# Altium project OTG_HUB.X3.PrjPcb
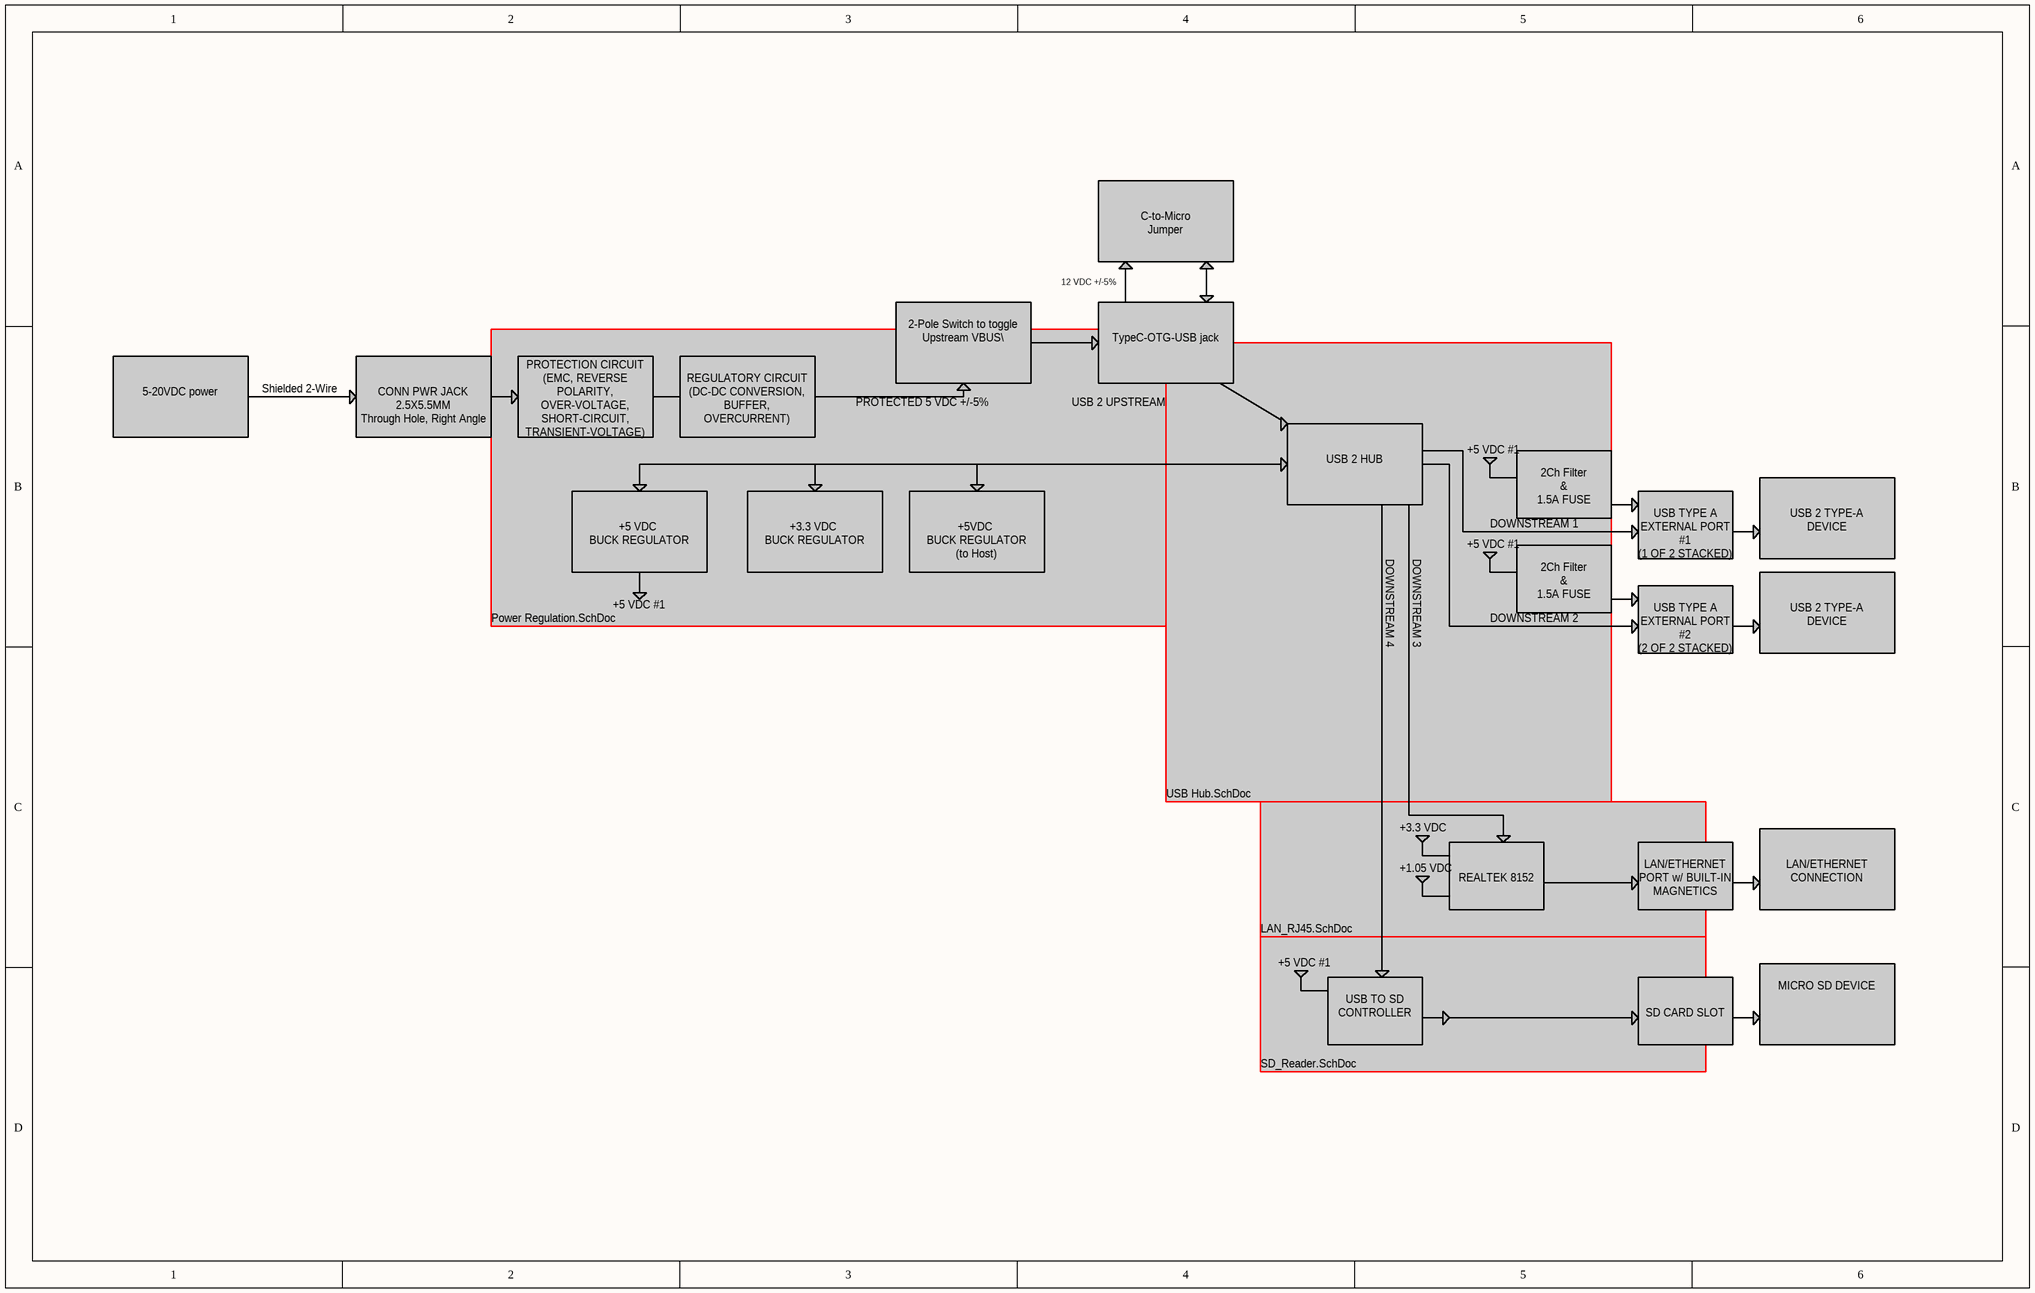
[diagram p0: Block Diagram.SchDoc]
5 sheets, 106 parts. Net scope: global (net labels, ports and power ports of the same name join across sheets).
Board file: OTG_HUB.PcbDoc
Sheets:
  Block Diagram.SchDoc
    12VDC, 5VDC, 5VDC. 3VDC, 1.2VDC = Power Regulation.SchDoc
    12VDC, 5VDC, 5VDC. 3VDC, 1.2VDC = USB Hub.SchDoc
    12VDC, 5VDC, 5VDC. 3VDC, 1.2VDC = LAN_RJ45.SchDoc
    12VDC, 5VDC, 5VDC. 3VDC, 1.2VDC = SD_Reader.SchDoc

## Sheet Block Diagram.SchDoc: OTG PUCK
size B; DrawnBy: KEW; RevisionEngineer: KEW; ProjectTitle: OTG PUCK; Revision: X2; SheetNumber: 1; SheetTotal: 5; RevisionDescription: Initial; DrawnByDate: 10/18/2022; ProjectNumber: TBD; AssemblyNumber: 7150-XXXX; RevisionDate: 10/18/2022; SheetTitle: Block Diagram; Date: 10/18/2022; ApprovedBy: KEW; CheckedBy: KEW; Author: KEW; CompanyName: Gamber-Johnson LLC.; Engineer: KEW; Organization: Gamber-Johnson LLC.; Address1: 5001 Joerns Dr.; Address2: Stevens Point; Address3: WI, 54481; DocumentNumber: TBD; Application_BuildNumber: TBD; Time: 9:29AM

### Sub-sheets
12VDC, 5VDC, 5VDC. 3VDC, 1.2VDC = Power Regulation.SchDoc: no entries
12VDC, 5VDC, 5VDC. 3VDC, 1.2VDC = USB Hub.SchDoc: no entries
12VDC, 5VDC, 5VDC. 3VDC, 1.2VDC = LAN_RJ45.SchDoc: no entries
12VDC, 5VDC, 5VDC. 3VDC, 1.2VDC = SD_Reader.SchDoc: no entries

### Notes on the sheet
- 12 VDC +/-5%
- C-to-Micro
  Jumper
- 5-20VDC power
- Shielded 2-Wire
- CONN PWR JACK 2.5X5.5MM
  Through Hole, Right Angle
- PROTECTION CIRCUIT
  (EMC, REVERSE POLARITY, OVER-VOLTAGE, SHORT-CIRCUIT, TRANSIENT-VOLTAGE)
- REGULATORY CIRCUIT
  (DC-DC CONVERSION,
  BUFFER, OVERCURRENT)
- PROTECTED 5 VDC +/-5%
- 2-Pole Switch to toggle Upstream VBUS\
- USB 2 UPSTREAM
- TypeC-OTG-USB jack
- USB 2 HUB
- +5 VDC #1
- +5 VDC
  BUCK REGULATOR
- +3.3 VDC
  BUCK REGULATOR
- +5VDC
  BUCK REGULATOR
  (to Host)
- DOWNSTREAM 4
- DOWNSTREAM 3
- DOWNSTREAM 1
- 2Ch Filter
  &
  1.5A FUSE
- USB TYPE A
  EXTERNAL PORT #1
  (1 OF 2 STACKED)
- USB 2 TYPE-A
  DEVICE
- DOWNSTREAM 2
- USB TYPE A
  EXTERNAL PORT #2
  (2 OF 2 STACKED)
- +3.3 VDC
- +1.05 VDC
- REALTEK 8152
- LAN/ETHERNET PORT w/ BUILT-IN MAGNETICS
- LAN/ETHERNET CONNECTION
- USB TO SD CONTROLLER
- SD CARD SLOT
- MICRO SD DEVICE
- REV
- REVISIONS
- DATE
- DESCRIPTION
- BY
- UNLESS OTHERWISE SPECIFIED, DRAWING DEFINITIONS AND TOLERANCES SHALL BE FOUND UNDER SUPPLIER STANDARDS SS-001. THIS PART AND ALL COMPONENTS OF IT MUST BE RoHS & REACH COMPLIANT. A CERTIFICATE OF COMPLIANCE MUST BE PROVIDED UPON REQUEST.
- ALL INFORMATION ON THIS DOCUMENT IS THE SOLE PROPERTY OF GAMBER-JOHNSON AND SHALL NOT BE COPIED, REPRODUCED, USED OR DISCLOSED IN WHOLE OR IN PART WITHOUT THE WRITTEN CONSENT OF GAMBER-JOHNSON
- TOLERANCES
  .00 ± .060
  .000 ± .020
  .0000 ± .005
  ANGELS ± 1°
- DRAWN BY:
- PROJECT NUMBER:
- SHEET TITLE:
- SHEET
- OF
- DATE:
- LOCATION:
- ASSEMBLY NUMBER
- SIZE
- GAMBER-JOHNSON LLC
  5001 JOERNS DR.
  STEVENS POINT, WI 54481
  +1 (715) 344-5209
- B

## Sheet Power Regulation.SchDoc: OTG Dock Puck
size A; Date: 12/6/2021; ApprovedBy: KEW; CheckedBy: KEW; Author: KEW; CompanyName: Gamber-Johnson LLC; Engineer: KEW; Organization: Gamber-Johnson LLC; Address1: 5001 Joerns Dr.; Address2: Stevens Point; Address3: WI, 54481; DocumentNumber: KEW-OTG; DrawnBy: KEW; RevisionEngineer: KEW; ProjectTitle: USB-OTG Puck; Revision: X2; SheetNumber: 4; SheetTotal: 5; RevisionDescription: Updated pads for X1,2 and RJ45 Port; DrawnByDate: 1/18/2023; ProjectNumber: TBD; AssemblyNumber: 7150-XXXX; RevisionDate: 1/25/2023; SheetTitle: Power Regulation; Time: 9:34 AM; Application_BuildNumber: 7150-XXX
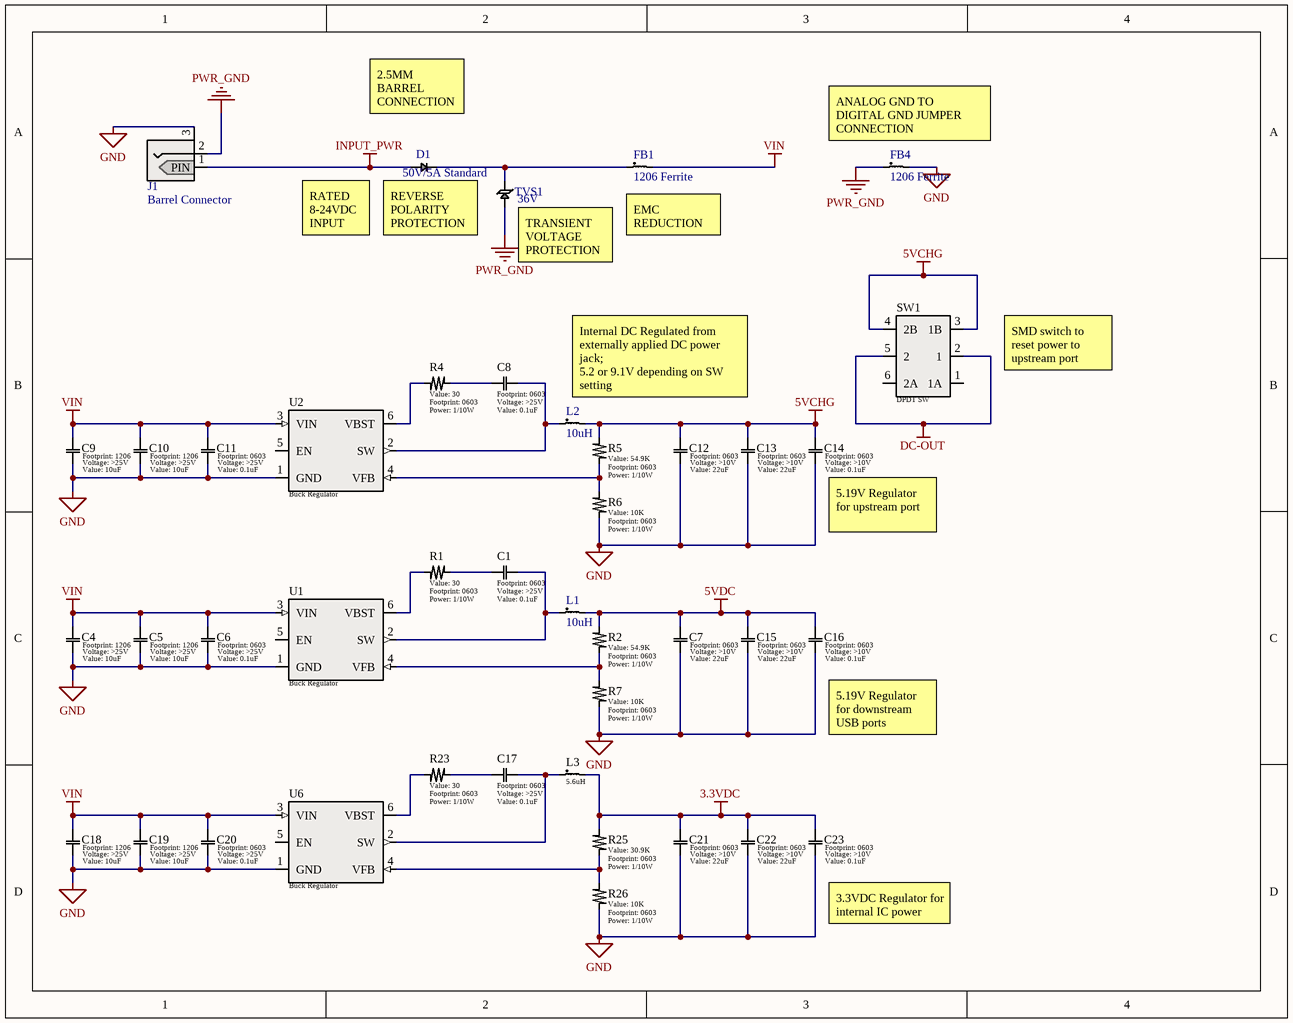
[diagram p1: Power Regulation.SchDoc]

### Parts
C1  value 0.1uF  Voltage: >25V  [0603]  (hidden comment: Generic Capacitor)
C4  value 10uF  Voltage: >25V  [1206]  (hidden comment: Generic Capacitor)
C5  value 10uF  Voltage: >25V  [1206]  (hidden comment: Generic Capacitor)
C6  value 0.1uF  Voltage: >25V  [0603]  (hidden comment: Generic Capacitor)
C7  value 22uF  Voltage: >10V  [0603]  (hidden comment: Generic Capacitor)
C8  value 0.1uF  Voltage: >25V  [0603]  (hidden comment: Generic Capacitor)
C9  value 10uF  Voltage: >25V  [1206]  (hidden comment: Generic Capacitor)
C10  value 10uF  Voltage: >25V  [1206]  (hidden comment: Generic Capacitor)
C11  value 0.1uF  Voltage: >25V  [0603]  (hidden comment: Generic Capacitor)
C12  value 22uF  Voltage: >10V  [0603]  (hidden comment: Generic Capacitor)
C13  value 22uF  Voltage: >10V  [0603]  (hidden comment: Generic Capacitor)
C14  value 0.1uF  Voltage: >10V  [0603]  (hidden comment: Generic Capacitor)
C15  value 22uF  Voltage: >10V  [0603]  (hidden comment: Generic Capacitor)
C16  value 0.1uF  Voltage: >10V  [0603]  (hidden comment: Generic Capacitor)
C17  value 0.1uF  Voltage: >25V  [0603]  (hidden comment: Generic Capacitor)
C18  value 10uF  Voltage: >25V  [1206]  (hidden comment: Generic Capacitor)
C19  value 10uF  Voltage: >25V  [1206]  (hidden comment: Generic Capacitor)
C20  value 0.1uF  Voltage: >25V  [0603]  (hidden comment: Generic Capacitor)
C21  value 22uF  Voltage: >10V  [0603]  (hidden comment: Generic Capacitor)
C22  value 22uF  Voltage: >10V  [0603]  (hidden comment: Generic Capacitor)
C23  value 0.1uF  Voltage: >10V  [0603]  (hidden comment: Generic Capacitor)
D1  50V/5A Standard  [DO-214AC]
FB1  1206 Ferrite  [1206]
FB4  1206 Ferrite  [1206]
J1  Barrel Connector  [PJ-082BH]
L1  10uH  [SMD 8.2x8.6mm]
L2  10uH  [SMD 8.2x8.6mm]
L3  5.6uH  [TMPC0402HP]
R1  value 30  Power: 1/10W  [0603]  (hidden comment: Generic Resistor)
R2  value 54.9K  Power: 1/10W  [0603]  (hidden comment: Generic Resistor)
R4  value 30  Power: 1/10W  [0603]  (hidden comment: Generic Resistor)
R5  value 54.9K  Power: 1/10W  [0603]  (hidden comment: Generic Resistor)
R6  value 10K  Power: 1/10W  [0603]  (hidden comment: Generic Resistor)
R7  value 10K  Power: 1/10W  [0603]  (hidden comment: Generic Resistor)
R23  value 30  Power: 1/10W  [0603]  (hidden comment: Generic Resistor)
R25  value 30.9K  Power: 1/10W  [0603]  (hidden comment: Generic Resistor)
R26  value 10K  Power: 1/10W  [0603]  (hidden comment: Generic Resistor)
SW1  DPDT SW  [SMD-DPDT-SW]
TVS1  36V  [DO-214AC]
U1  Buck Regulator  [TSOT-23-6]
U2  Buck Regulator  [TSOT-23-6]
U6  Buck Regulator  [TSOT-23-6]

### Nets
3.3VDC: C21.1 C22.1 C23.1 L3.2 R25.2
5VCHG: C12.1 C13.1 C14.1 L2.2 R5.2 SW1.3(1B) SW1.4(2B)
5VDC: C7.1 C15.1 C16.1 L1.2 R2.2
DC-OUT: SW1.2(1) SW1.5(2)
GND: C4.2 C5.2 C6.2 C7.2 C9.2 C10.2 C11.2 C12.2 C13.2 C14.2 C15.2 C16.2 C18.2 C19.2 C20.2 C21.2 C22.2 C23.2 FB4.2 J1.3(SHD_B) R6.1 R7.1 R26.1 U1.1(GND) U2.1(GND) U6.1(GND)
INPUT_PWR: D1.2(Anode) J1.1(PIN)
PWR_GND: FB4.1 J1.2(SHD_A) TVS1.2(Anode)
VIN: C4.1 C5.1 C6.1 C9.1 C10.1 C11.1 C18.1 C19.1 C20.1 FB1.2 U1.3(VIN) U2.3(VIN) U6.3(VIN)
NetC1_1: C1.1 R1.2
NetC1_2: C1.2 L1.1 U1.2(SW)
NetC8_1: C8.1 R4.2
NetC8_2: C8.2 L2.1 U2.2(SW)
NetC17_1: C17.1 R23.2
NetC17_2: C17.2 L3.1 U6.2(SW)
NetD1_1: D1.1(Cathode) FB1.1 TVS1.1(Cathode)
NetR1_1: R1.1 U1.6(VBST)
NetR2_1: R2.1 R7.2 U1.4(VFB)
NetR4_1: R4.1 U2.6(VBST)
NetR5_1: R5.1 R6.2 U2.4(VFB)
NetR23_1: R23.1 U6.6(VBST)
NetR25_1: R25.1 R26.2 U6.4(VFB)

Not connected (* = marked no-connect by the designer): SW1 1(1A) 6(2A); U1 5(EN); U2 5(EN); U6 5(EN)

### Notes on the sheet
- 2.5MM BARREL CONNECTION
- (near FB4) ANALOG GND TO DIGITAL GND JUMPER CONNECTION
- (near D1) RATED 8-24VDC INPUT
- (near D1) REVERSE POLARITY PROTECTION
- (near FB1) EMC REDUCTION
- (near TVS1) TRANSIENT VOLTAGE PROTECTION
- SMD switch to reset power to upstream port
- (near L2) Internal DC Regulated from
  externally applied DC power jack;
  5.2 or 9.1V depending on SW setting
- (near C14) 5.19V Regulator for upstream port
- (near C16) 5.19V Regulator for downstream USB ports
- (near C23) 3.3VDC Regulator for internal IC power
- REV
- REVISIONS
- DATE
- DESCRIPTION
- BY
- UNLESS OTHERWISE SPECIFIED, DRAWING DEFINITIONS AND TOLERANCES SHALL BE FOUND UNDER SUPPLIER STANDARDS SS-001. THIS PART AND ALL COMPONENTS OF IT MUST BE RoHS & REACH COMPLIANT. A CERTIFICATE OF COMPLIANCE MUST BE PROVIDED UPON REQUEST.
- ALL INFORMATION ON THIS DOCUMENT IS THE SOLE PROPERTY OF GAMBER-JOHNSON AND SHALL NOT BE COPIED, REPRODUCED, USED OR DISCLOSED IN WHOLE OR IN PART WITHOUT THE WRITTEN CONSENT OF GAMBER-JOHNSON
- TOLERANCES
  .00 ± .060
  .000 ± .020
  .0000 ± .005
  ANGELS ± 1°
- DRAWN BY:
- PROJECT NUMBER:
- SHEET TITLE:
- SHEET
- OF
- DATE:
- LOCATION:
- ASSEMBLY NUMBER
- SIZE
- GAMBER-JOHNSON LLC
  3001 BORHAM AVE.
  STEVENS POINT, WI 54481
  +1 (715) 344-5209
- B

### Library data of the parts
C1 C4-C6 C8-C11 C14 C16-C20 C23 = Generic Capacitor: Tolerance: 10%
C7 C12 C13 C15 C21 C22 = Generic Capacitor: Tolerance: 20%
D1 = SBRT5A50SA-13: Diode Super Barrier 50V 5A Surface Mount; Manufacturer 1: Diodes; Element Configuration: Single; Forward Voltage: 460mV; Max Forward Surge Current (Ifsm): 70A; Max Reverse Current: 45mA; Supplier 1: Digi-Key; Manufacturer Part Number 1: SBRT5A50SA-13; RoHS: Yes; Category: Rectifier Diodes; Stock 1: 218992; Pricing 1: 1=0.49000, 10=0.38200, 100=0.22900, 500=0.21200, 1000=0.14416, 2000=0.13271 (USD); Mount: Surface Mount; Case/Package: SMA; Weight: 0.002258oz; Min Operating Temperature: -55°C; Max Operating Temperature: 150°C; Packaging: Tape and Reel; Average Rectified Current: 5A; Max Repetitive Reverse Voltage (Vrrm): 50V; Package Quantity: 5000; Max Reverse Voltage (DC): 50V; Lead Free: Lead Free; RoHS Compliant: Yes; ComponentLink1URL: http://www.farnell.com/datasheets/2814462.pdf?src-supplier=Farnell; ComponentLink1Description: http://www.farnell.com/datasheets/2814462.pdf?src-supplier=Farnell; ComponentLink2URL: https://www.diodes.com/assets/Datasheets/SBRT5A50SA.pdf?src-supplier=Arrow+Electronics; ComponentLink2Description: https://www.diodes.com/assets/Datasheets/SBRT5A50SA.pdf?src-supplier=Arrow+Electronics; ComponentLink3URL: https://www.diodes.com/assets/Datasheets/SBRT5A50SA.pdf?src-supplier=Mouser; ComponentLink3Description: https://www.diodes.com/assets/Datasheets/SBRT5A50SA.pdf?src-supplier=Mouser; ComponentLink4URL: https://www.diodes.com/assets/Datasheets/SBRT5A50SA.pdf?src-supplier=Avnet+Europe; ComponentLink4Description: https://www.diodes.com/assets/Datasheets/SBRT5A50SA.pdf?src-supplier=Avnet+Europe; ComponentLink5URL: http://www.farnell.com/datasheets/2814462.pdf?src-supplier=Newark; ComponentLink5Description: http://www.farnell.com/datasheets/2814462.pdf?src-supplier=Newark; ComponentLink6URL: https://www.diodes.com/assets/Datasheets/SBRT5A50SA.pdf?src-supplier=Avnet; ComponentLink6Description: https://www.diodes.com/assets/Datasheets/SBRT5A50SA.pdf?src-supplier=Avnet; ComponentLink7URL: https://www.diodes.com/assets/Datasheets/SBRT5A50SA.pdf?src-supplier=Digi-Key; ComponentLink7Description: https://www.diodes.com/assets/Datasheets/SBRT5A50SA.pdf?src-supplier=Digi-Key; ComponentLink8URL: http://www.farnell.com/datasheets/2814462.pdf?src-supplier=Element14; ComponentLink8Description: http://www.farnell.com/datasheets/2814462.pdf?src-supplier=Element14; ComponentLink9URL: https://www.diodes.com/assets/Datasheets/SBRT5A50SA.pdf?src-supplier=Verical; ComponentLink9Description: https://www.diodes.com/assets/Datasheets/SBRT5A50SA.pdf?src-supplier=Verical; Supplier Part Number 1: SBRT5A50SA-13DICT-ND
FB1 FB4 = HI1206T161R-10: 160 Ohms @ 100MHz 1 Power, Signal Line Ferrite Bead 1206 (3216 Metric) 6A 18mOhm; Manufacturer 1: Laird Steward; DC Resistance (DCR): 18mR; Number of Lines: 1; Impedance: 160R; Supplier 1: Digi-Key; Manufacturer Part Number 1: HI1206T161R-10; RoHS: Yes; Category: Fixed Inductors; Stock 1: 250713; Pricing 1: 1=0.20000, 10=0.15600, 25=0.12920, 50=0.11140, 100=0.10020, 250=0.08464, 500=0.07572, 1000=0.06458 (USD); Mount: Surface Mount; Case/Package: 1206; Weight: 0.0136oz; Case Code (Metric): 3216; Case Code (Imperial): 1206; Core Material: Ferrite; Material: Ferrite; Min Operating Temperature: -40°C; Max Operating Temperature: 125°C; Package Quantity: 1; Packaging: Tape and Reel; Max Current Rating: 6A; Current Rating: 6A; Max DC Current: 6A; Termination: SMD/SMT; Frequency: 100MHz; Test Frequency: 100MHz; Length: 3.2mm; Height: 0.071inch; Width: 0.063inch; Depth: 1.8mm; Lead Free: Lead Free; REACH SVHC: Unknown; ComponentLink1URL: https://datasheet.ciiva.com/22622/1685743-22622771.pdf?src-supplier=Element14; ComponentLink1Description: https://datasheet.ciiva.com/22622/1685743-22622771.pdf?src-supplier=Element14; ComponentLink2URL: https://datasheet.ciiva.com/16714/70065439-16714326.pdf?src-supplier=Allied+Electronics; ComponentLink2Description: https://datasheet.ciiva.com/16714/70065439-16714326.pdf?src-supplier=Allied+Electronics; Supplier Part Number 1: 240-2411-1-ND; LCSC PN: C391193
J1 = PJ-082BH: CONN PWR JACK 2.5X5.5MM SOLDER; Manufacturer 1: CUI; Gender: Male; Shielding: Shielded; Current Rating: 10A; Number of Conductors: 2; Supplier 1: Digi-Key; Manufacturer Part Number 1: PJ-082BH; RoHS: Yes; Category: Connectors; Stock 1: 24371; Pricing 1: 1=1.69000, 10=1.53600, 25=1.44200, 50=1.37940, 100=1.31670 (USD); Mount: Through Hole; Color: Black; Contact Material: Brass; Housing Material: Nylon; Contact Plating: Silver; Housing Color: Black; Min Operating Temperature: -25°C; Max Operating Temperature: 85°C; Orientation: Horizontal; Connector Type: Jack; Termination: Solder; Lead Free: Lead Free; ComponentLink1URL: https://datasheet.ciiva.com/7368/pj-082bh-7368042.pdf?src-supplier=Digi-Key; ComponentLink1Description: https://datasheet.ciiva.com/7368/pj-082bh-7368042.pdf?src-supplier=Digi-Key; ComponentLink2URL: https://datasheet.ciiva.com/7368/pj-082bh-7368045.pdf?src-supplier=Digi-Key; ComponentLink2Description: https://datasheet.ciiva.com/7368/pj-082bh-7368045.pdf?src-supplier=Digi-Key; Supplier Part Number 1: CP-082BHCT-ND; LCSC PN: C3001296
L1 L2 = IHLP3232DZER100M5A: 5.1A 10uH ±20% 5.2A - Power Inductor; Mfr_Name: Vishay; Type: DEV; Copyright: Copyright (C) 2023 Ultra Librarian. All rights reserved.; Manufacturer_Part_Number: IHLP3232DZER100M5A; RefDes: RefDes; LCSC PN: C2051768; Supplier 1: Mouser
L3 = TMPC0402HP-5R6MG-Z02: 2A 5.6uH ±20% SMD Power Inductor; LCSC PN: C357137; Supplier 1: Digi-Key; Supplier Part Number 1: 732-3339-1-ND
R1 R2 R4-R7 R23 R25 R26 = Generic Resistor: Tolerance: 1%
SW1 = MS-22D17-G2: Brick nogging DPDT Black SMD Slide Switch; LCSC PN: C2904912
TVS1 = SMAJ36A: 58.1V Clamp 6.9A Ipp Tvs Diode Surface Mount DO-214AC (SMA); Manufacturer 1: Littelfuse; Peak Pulse Power: 400W; Polarity: Unidirectional; Breakdown Voltage: 40V; Test Current: 1mA; Number of Channels: 1; Leakage Current: 1uA; Max Power Dissipation: 3.3W; Power Line Protection: No; Max Breakdown Voltage: 44.2V; Supplier 1: Digi-Key; Manufacturer Part Number 1: SMAJ36A; RoHS: Yes; Category: TVS Diodes; Stock 1: 65200; Pricing 1: 1=0.41000, 10=0.27500, 100=0.15750, 500=0.11000, 1000=0.08750, 2000=0.08500 (USD); Mount: Surface Mount; Number of Pins: 2; Min Operating Temperature: -65°C; Max Operating Temperature: 150°C; Clamping Voltage: 58.1V; Packaging: Tape and Reel; Reverse Standoff Voltage: 36V; Peak Pulse Current: 6.9A; Max Surge Current: 6.9A; Package Quantity: 5000; Operating Supply Voltage: 36V; Reverse Breakdown Voltage: 40V; Min Breakdown Voltage: 40V; Number of Elements: 1; Termination: SMD/SMT; Direction: Unidirectional; Resistor Type: Zener; Number of Unidirectional Channels: 1; Voltage Rating (DC): 36V; Power Dissipation: 400W; Length: 5.28mm; Height: 2.29mm; Width: 2.79mm; Lead Free: Lead Free; REACH SVHC: No SVHC; ComponentLink1URL: https://datasheet.ciiva.com/330/littelfuse-tvs-diode-smaj-datasheet-pdf-330760.pdf?src-supplier=Digi-Key; ComponentLink1Description: https://datasheet.ciiva.com/330/littelfuse-tvs-diode-smaj-datasheet-pdf-330760.pdf?src-supplier=Digi-Key; ComponentLink2URL: https://datasheet.ciiva.com/330/littelfuse-tvs-diode-smaj-datasheet-pdf-330762.pdf?src-supplier=Digi-Key; ComponentLink2Description: https://datasheet.ciiva.com/330/littelfuse-tvs-diode-smaj-datasheet-pdf-330762.pdf?src-supplier=Digi-Key; ComponentLink3URL: https://datasheet.ciiva.com/28473/607617-28473423.pdf?src-supplier=Element14; ComponentLink3Description: https://datasheet.ciiva.com/28473/607617-28473423.pdf?src-supplier=Element14; ComponentLink4URL: https://datasheet.ciiva.com/330/littelfuse-tvs-diode-smaj-datasheet-pdf-330761.pdf?src-supplier=Digi-Key; ComponentLink4Description: https://datasheet.ciiva.com/330/littelfuse-tvs-diode-smaj-datasheet-pdf-330761.pdf?src-supplier=Digi-Key; ComponentLink5URL: https://datasheet.ciiva.com/16487/littelfuse-tvs-diode-smaj-16487437.pdf?src-supplier=Future+Electronics; ComponentLink5Description: https://datasheet.ciiva.com/16487/littelfuse-tvs-diode-smaj-16487437.pdf?src-supplier=Future+Electronics; Supplier Part Number 1: SMAJ36ALFCT-ND
U1 U2 U6 = TPS56339DDCR: Buck Switching Regulator IC Positive Adjustable 0.8V 1 Output 3A SOT-23-6 Thin, TSOT-23-6; Manufacturer: Texas Instruments; Supplier 1: Digi-Key; Manufacturer Part Number: TPS56339DDCR; RoHS: Yes; Category: Voltage Regulators - Switching; Pricing 1: 1=1.39000, 10=1.24100, 25=1.17840, 100=0.96790, 250=0.90476, 500=0.79956, 1000=0.69475 (USD); Supplier Part Number 1: 296-53568-6-ND; LCSC PN: C2071106

## Sheet USB Hub.SchDoc: ET4X Full Dock
size A; Date: 12/7/2021; ApprovedBy: KEW; CheckedBy: KEW; Author: KEW; CompanyName: Gamber-Johnson LLC; Engineer: KEW; Organization: Gamber-Johnson LLC; Address1: 5001 Joerns Dr.; Address2: Stevens Point; Address3: WI, 54481; DocumentNumber: TBD; DrawnBy: KEW; RevisionEngineer: KEW; ProjectTitle: USB-OTG Puck; Revision: X2; SheetNumber: 2; SheetTotal: 5; RevisionDescription: Genesys USB2.0 hub; DrawnByDate: 1/18/2023; ProjectNumber: 7150-0297; AssemblyNumber: 7150-0297; RevisionDate: 1/18/2023; SheetTitle: USB Hub; Time: 1:27 PM; Application_BuildNumber: TBD
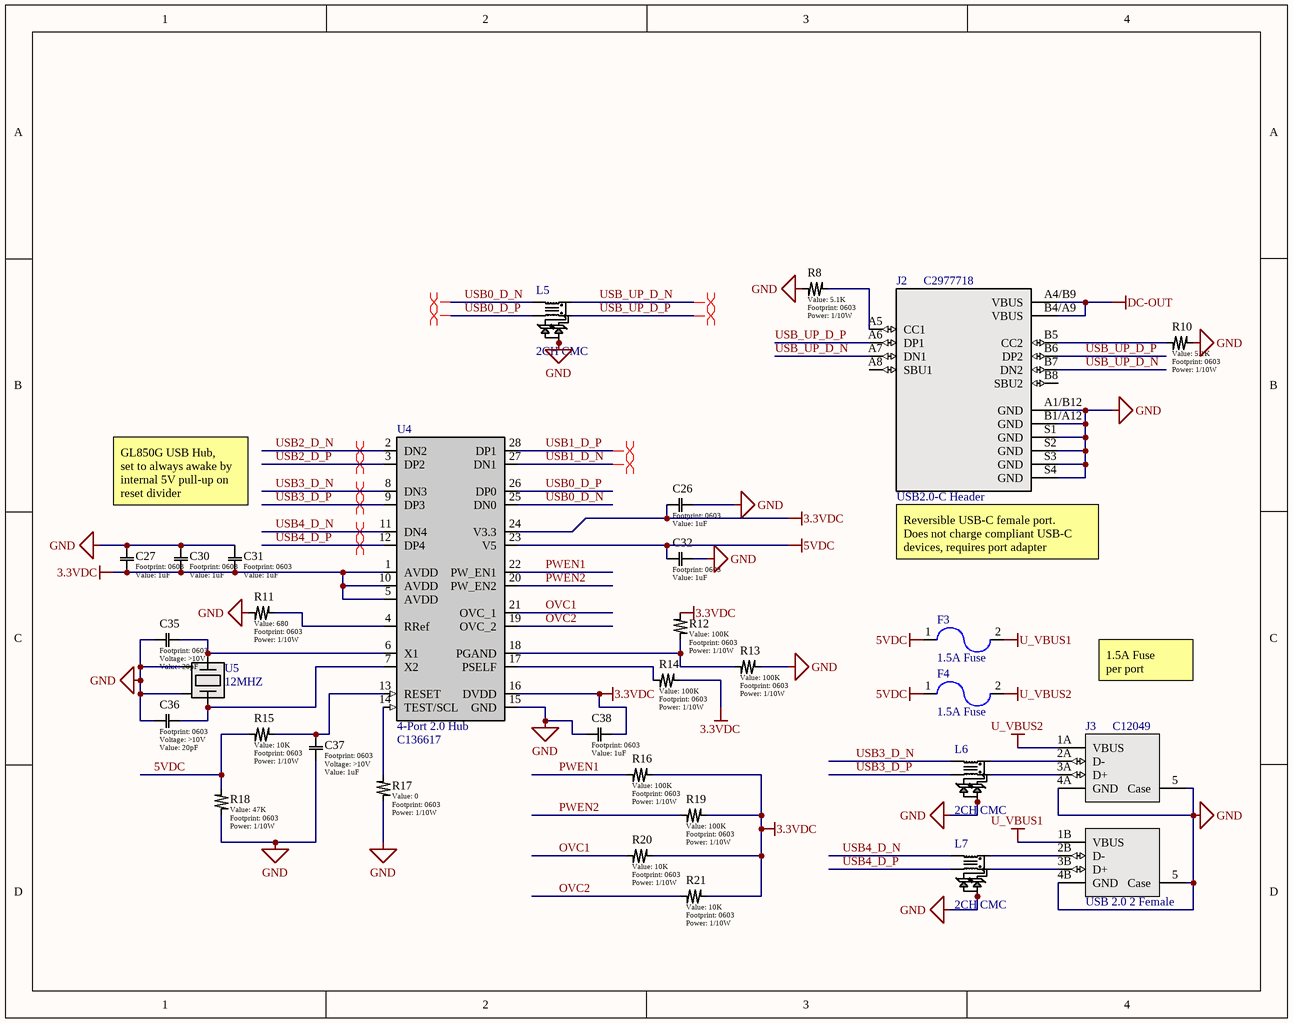
[diagram p2: USB Hub.SchDoc]

### Parts
C26  value 1uF  [0603]  (hidden comment: Generic Capacitor)
C27  value 1uF  [0603]  (hidden comment: Generic Capacitor)
C30  value 1uF  [0603]  (hidden comment: Generic Capacitor)
C31  value 1uF  [0603]  (hidden comment: Generic Capacitor)
C32  value 1uF  [0603]  (hidden comment: Generic Capacitor)
C35  value 20pF  Voltage: >10V  [0603]  (hidden comment: Generic Capacitor)
C36  value 20pF  Voltage: >10V  [0603]  (hidden comment: Generic Capacitor)
C37  value 1uF  Voltage: >10V  [0603]  (hidden comment: Generic Capacitor)
C38  value 1uF  [0603]  (hidden comment: Generic Capacitor)
F3  1.5A Fuse  [1206 Fuse]
F4  1.5A Fuse  [1206 Fuse]
J2  USB2.0-C Header  LCSC PN: C2977718  [USB4110-GF-A]
J3  USB 2.0 2 Female  LCSC PN: C12049  [907-111A1022D10200]
L5  2CH CMC  [SMD-6-2CH]
L6  2CH CMC  [SMD-6-2CH]
L7  2CH CMC  [SMD-6-2CH]
R8  value 5.1K  Power: 1/10W  [0603]  (hidden comment: Generic Resistor)
R10  value 5.1K  Power: 1/10W  [0603]  (hidden comment: Generic Resistor)
R11  value 680  Power: 1/10W  [0603]  (hidden comment: Generic Resistor)
R12  value 100K  Power: 1/10W  [0603]  (hidden comment: Generic Resistor)
R13  value 100K  Power: 1/10W  [0603]  (hidden comment: Generic Resistor)
R14  value 100K  Power: 1/10W  [0603]  (hidden comment: Generic Resistor)
R15  value 10K  Power: 1/10W  [0603]  (hidden comment: Generic Resistor)
R16  value 100K  Power: 1/10W  [0603]  (hidden comment: Generic Resistor)
R17  value 0  Power: 1/10W  [0603]  (hidden comment: Generic Resistor)
R18  value 47K  Power: 1/10W  [0603]  (hidden comment: Generic Resistor)
R19  value 100K  Power: 1/10W  [0603]  (hidden comment: Generic Resistor)
R20  value 10K  Power: 1/10W  [0603]  (hidden comment: Generic Resistor)
R21  value 10K  Power: 1/10W  [0603]  (hidden comment: Generic Resistor)
U4  4-Port 2.0 Hub  LCSC PN: C136617  [GL850G-HHY22]
U5  12MHZ  [SMD2520-4P]

### Nets
3.3VDC: C26.1 C27.1 C30.1 C31.1 C38.2 R12.2 R14.2 R16.2 R19.2 R20.2 R21.2 U4.1(AVDD) U4.5(AVDD) U4.10(AVDD) U4.16(DVDD) U4.24(V3.3)
5VDC: C32.1 F3.1 F4.1 R15.1 R18.1 U4.23(V5)
DC-OUT: J2.A4/B9(VBUS) J2.B4/A9(VBUS)
GND: C26.2 C27.2 C30.2 C31.2 C32.2 C35.2 C36.2 C37.1 C38.1 J2.A1/B12(GND) J2.B1/A12(GND) J2.S1(GND) J2.S2(GND) J2.S3(GND) J2.S4(GND) J3.4A(GND) J3.4B(GND) J3.5(Case) L5.5 L5.6 L6.5 L6.6 L7.5 L7.6 R8.1 R10.2 R11.2 R13.2 R17.2 R18.2 U4.15(GND) U5.2(GND) U5.4(GND)
U_VBUS1: F3.2 J3.1B(VBUS)
U_VBUS2: F4.2 J3.1A(VBUS)
OVC1: R20.1 U4.21(OVC_1)
OVC2: R21.1 U4.19(OVC_2)
PWEN1: R16.1 U4.22(PW_EN1)
PWEN2: R19.1 U4.20(PW_EN2)
USB0_D_N: L5.4 U4.25(DN0)
USB0_D_P: L5.3 U4.26(DP0)
USB1_D_N: U4.27(DN1)
USB1_D_P: U4.28(DP1)
USB2_D_N: U4.2(DN2)
USB2_D_P: U4.3(DP2)
USB3_D_N: L6.4 U4.8(DN3)
USB3_D_P: L6.3 U4.9(DP3)
USB4_D_N: L7.4 U4.11(DN4)
USB4_D_P: L7.3 U4.12(DP4)
USB_UP_D_N: J2.A7(DN1) J2.B7(DN2) L5.1
USB_UP_D_P: J2.A6(DP1) J2.B6(DP2) L5.2
NetC35_1: C35.1 U4.6(X1) U5.1
NetC36_1: C36.1 U4.7(X2) U5.3
NetC37_2: C37.2 R15.2 U4.13(RESET)
NetJ2_A5: J2.A5(CC1) R8.2
NetJ2_B5: J2.B5(CC2) R10.1
NetJ3_2A: J3.2A(D-) L6.1
NetJ3_2B: J3.2B(D-) L7.1
NetJ3_3A: J3.3A(D+) L6.2
NetJ3_3B: J3.3B(D+) L7.2
NetR11_1: R11.1 U4.4(RRef)
NetR12_1: R12.1 R13.1 U4.18(PGAND)
NetR14_1: R14.1 U4.17(PSELF)
NetR17_1: R17.1 U4.14(TEST/SCL)

Not connected (* = marked no-connect by the designer): J2 A8(SBU1) B8(SBU2)

### Layout directives
differential pair: USB0_D_N, USB0_D_P, USB1_D_N, USB1_D_P, USB2_D_N, USB2_D_P, USB3_D_N, USB3_D_P, USB4_D_N, USB4_D_P, USB_UP_D_N, USB_UP_D_P

### Notes on the sheet
- GL850G USB Hub,
  set to always awake by internal 5V pull-up on reset divider
- (near J2) Reversible USB-C female port.
  Does not charge compliant USB-C devices, requires port adapter
- 1.5A Fuse
  per port
- REV
- REVISIONS
- DATE
- DESCRIPTION
- BY
- UNLESS OTHERWISE SPECIFIED, DRAWING DEFINITIONS AND TOLERANCES SHALL BE FOUND UNDER SUPPLIER STANDARDS SS-001. THIS PART AND ALL COMPONENTS OF IT MUST BE RoHS & REACH COMPLIANT. A CERTIFICATE OF COMPLIANCE MUST BE PROVIDED UPON REQUEST.
- ALL INFORMATION ON THIS DOCUMENT IS THE SOLE PROPERTY OF GAMBER-JOHNSON AND SHALL NOT BE COPIED, REPRODUCED, USED OR DISCLOSED IN WHOLE OR IN PART WITHOUT THE WRITTEN CONSENT OF GAMBER-JOHNSON
- TOLERANCES
  .00 ± .060
  .000 ± .020
  .0000 ± .005
  ANGELS ± 1°
- DRAWN BY:
- PROJECT NUMBER:
- SHEET TITLE:
- SHEET
- OF
- DATE:
- LOCATION:
- ASSEMBLY NUMBER
- SIZE
- GAMBER-JOHNSON LLC
  3001 BORHAM AVE.
  STEVENS POINT, WI 54481
  +1 (715) 344-5209
- B

### Library data of the parts
C26 C27 C30-C32 C38 = Generic Capacitor: Voltage: >10V; Tolerance: 10%
C35-C37 = Generic Capacitor: Tolerance: 10%
F3 F4 = ASMD1206-075: 6V 750mA 100A 600mW -40℃~+85℃ 1.5A 90mΩ 200ms 500mΩ 1206 Resettable Fuses ROHS; LCSC PN: C135339
J2 = USB4110-GF-A: USB-C (USB TYPE-C) USB 2.0 Receptacle Connector 24 (16+8 Dummy) Position Surface Mount, Right Angle; Through Hole; Manufacturer 1: Global Connector Technology; Supplier 1: Newark; Manufacturer Part Number 1: USB4110-GF-A; RoHS: No; Pricing 1: 1=1.09000, 10=0.97500, 25=0.90200, 50=0.83800, 100=0.72900, 250=0.66000, 500=0.58700, 1000=0.56700 (USD); Supplier Part Number 1: 86AH2022
J3 = 907-111A1022D10200: USB 2.0 2 8 Female Type-A Plugin USB Connectors ROHS
L5-L7 = ICMEF112P350MFR: 35Ω@100MHz -40℃~+85℃ 4Ω 5V 2 100mA SMD Common Mode Filters ROHS; LCSC PN: C2903682
R8 R10-R21 = Generic Resistor: Tolerance: 1%
U4 = GL850G-HHY22: USB 2.0 Hub Controller
U5 = 7C012000RW1: 12MHz SMD Crystal Resonator 20pF ±10ppm ±20ppm SMD2520-4P Crystals ROHS; LCSC PN: C655059

## Sheet LAN_RJ45.SchDoc: TBD
size A; Date: 1/18/2023; ApprovedBy: KEW; CheckedBy: KEW; Author: KEW; CompanyName: Gamber-Johnson LLC; Engineer: KEW; Organization: Gamber-Johnson LLC; Address1: 5001 Joerns Dr.; Address2: Stevens Point; Address3: WI 54481; DocumentNumber: TBD; DrawnBy: KEW; RevisionEngineer: KEW; ProjectTitle: USB-OTG Puck; Revision: X2; SheetNumber: 3; SheetTotal: 5; RevisionDescription: Initial; DrawnByDate: 1/18/2023; ProjectNumber: 7150-0297; AssemblyNumber: 7150-XXXX; RevisionDate: 1/18/2023; SheetTitle: LAN_RJ45; Time: 7:43 AM; Application_BuildNumber: TBD
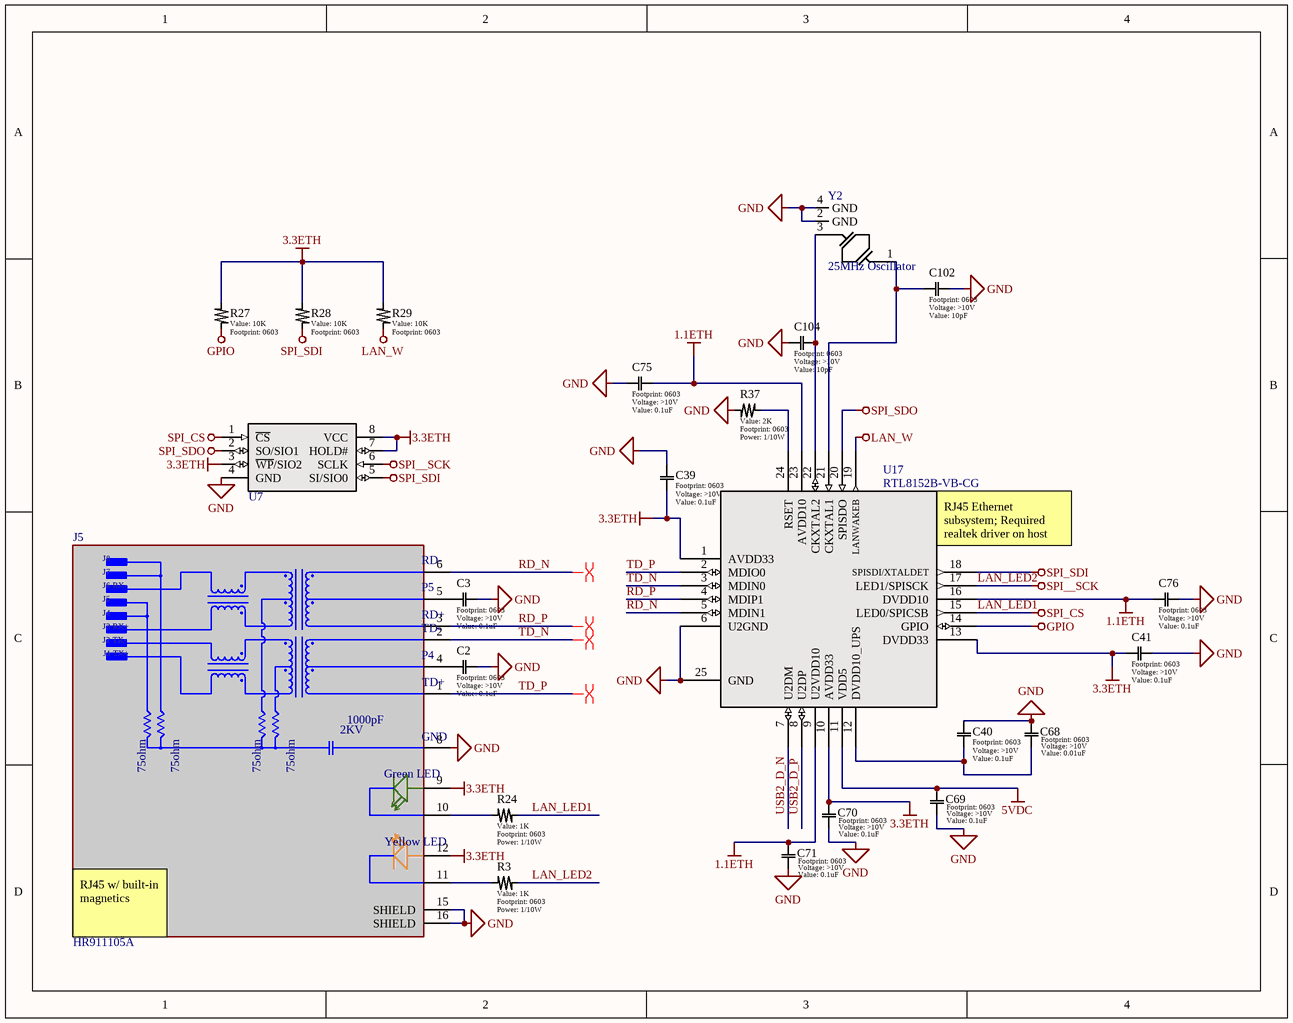
[diagram p3: LAN_RJ45.SchDoc]

### Parts
C2  value 0.1uF  Voltage: >10V  [0603]  (hidden comment: Generic Capacitor)
C3  value 0.1uF  Voltage: >10V  [0603]  (hidden comment: Generic Capacitor)
C39  value 0.1uF  Voltage: >10V  [0603]  (hidden comment: Generic Capacitor)
C40  value 0.1uF  Voltage: >10V  [0603]  (hidden comment: Generic Capacitor)
C41  value 0.1uF  Voltage: >10V  [0603]  (hidden comment: Generic Capacitor)
C68  value 0.01uF  Voltage: >10V  [0603]  (hidden comment: Generic Capacitor)
C69  value 0.1uF  Voltage: >10V  [0603]  (hidden comment: Generic Capacitor)
C70  value 0.1uF  Voltage: >10V  [0603]  (hidden comment: Generic Capacitor)
C71  value 0.1uF  Voltage: >10V  [0603]  (hidden comment: Generic Capacitor)
C75  value 0.1uF  Voltage: >10V  [0603]  (hidden comment: Generic Capacitor)
C76  value 0.1uF  Voltage: >10V  [0603]  (hidden comment: Generic Capacitor)
C102  value 10pF  Voltage: >10V  [0603]  (hidden comment: Generic Capacitor)
C104  value 10pF  Voltage: >10V  [0603]  (hidden comment: Generic Capacitor)
J5  HR911105A  [HR911105A]
R3  value 1K  Power: 1/10W  [0603]  (hidden comment: Generic Resistor)
R24  value 1K  Power: 1/10W  [0603]  (hidden comment: Generic Resistor)
R27  value 10K  [0603]  (hidden comment: Generic Resistor)
R28  value 10K  [0603]  (hidden comment: Generic Resistor)
R29  value 10K  [0603]  (hidden comment: Generic Resistor)
R37  value 2K  Power: 1/10W  [0603]  (hidden comment: Generic Resistor)
U7  FlashMem  [8-SOIC (0.209", 5.30mm WIDTH)]  (value not drawn)
U17  RTL8152B-VB-CG  [RTL8152B-VB-CG]
Y2  25MHz Oscillator  [ABM8G-25.000MHZ-B4Y-T]

### Nets
1.1ETH: C71.1 C75.1 C76.2 U17.9(U2VDD10) U17.16(DVDD10) U17.23(AVDD10)
3.3ETH: C39.1 C41.2 C70.1 J5.9(GA) J5.12(YA) R27.1 R28.1 R29.1 U7.3(~{WP}/SIO2) U7.7(HOLD#) U7.8(VCC) U17.1(AVDD33) U17.10(AVDD33) U17.13(DVDD33)
5VDC: C69.1 U17.11(VDD5)
GND: C2.1 C3.1 C39.2 C40.1 C41.1 C68.1 C69.2 C70.2 C71.2 C75.2 C76.1 C102.1 C104.2 J5.8(GND) J5.15(SHIELD) J5.16(SHIELD) R37.1 U7.4(GND) U17.6(U2GND) U17.25(GND) Y2.2(GND) Y2.4(GND)
GPIO: R27.2 U17.14(GPIO)
LAN_LED1: R24.2 U7.1(~{CS}) U17.15(LED0/SPICSB)  [also labelled SPI_CS]
LAN_LED2: R3.2 U7.6(SCLK) U17.17(LED1/SPISCK)  [also labelled SPI__SCK]
LAN_W: R29.2 U17.19(LANWAKEB)
SPI_SDI: R28.2 U7.5(SI/SIO0) U17.18(SPISDI/XTALDET)
SPI_SDO: U7.2(SO/SIO1) U17.20(SPISDO)
RD_N: J5.6(RD-) U17.5(MDIN1)
RD_P: J5.3(RD+) U17.4(MDIP1)
TD_N: J5.2(TD-) U17.3(MDIN0)
TD_P: J5.1(TD+) U17.2(MDIO0)
USB2_D_N: U17.7(U2DM)
USB2_D_P: U17.8(U2DP)
NetC2_2: C2.2 J5.4(P4)
NetC3_2: C3.2 J5.5(P5)
NetC40_2: C40.2 C68.2 U17.12(DVDD10_UPS)
NetC102_2: C102.2 U17.21(CKXTAL1) Y2.1
NetC104_1: C104.1 U17.22(CKXTAL2) Y2.3
NetJ5_10: J5.10(GC) R24.1
NetJ5_11: J5.11(YC) R3.1
NetR37_2: R37.2 U17.24(RSET)

### Layout directives
differential pair: RD_N, RD_P, TD_N, TD_P

### Notes on the sheet
- (near U17) RJ45 Ethernet subsystem; Required realtek driver on host
- RJ45 w/ built-in magnetics
- REV
- REVISIONS
- DATE
- DESCRIPTION
- BY
- UNLESS OTHERWISE SPECIFIED, DRAWING DEFINITIONS AND TOLERANCES SHALL BE FOUND UNDER SUPPLIER STANDARDS SS-001. THIS PART AND ALL COMPONENTS OF IT MUST BE RoHS & REACH COMPLIANT. A CERTIFICATE OF COMPLIANCE MUST BE PROVIDED UPON REQUEST.
- ALL INFORMATION ON THIS DOCUMENT IS THE SOLE PROPERTY OF GAMBER-JOHNSON AND SHALL NOT BE COPIED, REPRODUCED, USED OR DISCLOSED IN WHOLE OR IN PART WITHOUT THE WRITTEN CONSENT OF GAMBER-JOHNSON
- TOLERANCES
  .00 ± .060
  .000 ± .020
  .0000 ± .005
  ANGELS ± 1°
- DRAWN BY:
- PROJECT NUMBER:
- SHEET TITLE:
- SHEET
- OF
- DATE:
- LOCATION:
- ASSEMBLY NUMBER
- SIZE
- GAMBER-JOHNSON LLC
  3001 BORHAM AVE.
  STEVENS POINT, WI 54481
  +1 (715) 344-5209
- B
- (in symbol HR911105A) J8; J7; J6 RX-; J4; J3 RX+; J2 TX-; J1 TX+; 1000pF; 75ohm; 2KV; Green LED; Yellow LED

### Library data of the parts
C2 C3 C39-C41 C68-C71 C75 C76 C102 C104 = Generic Capacitor: Tolerance: 10%
J5 = HR911105A: RJ45 Receptacle 1 WithLED Plugin Ethernet; LCSC PN: C12074
R3 R24 R37 = Generic Resistor: Tolerance: 1%
R27-R29 = Generic Resistor: Tolerance: 1%; Power: 1/10W
U7 = MX25L1606EM2I-12G: 16Mbit SPI SOIC-8-208mil NOR FLASH; Supplier 1: Digi-Key; Supplier Part Number 1: 1092-1135-ND; LCSC PN: C18192
U17 = RTL8152B-VB-CG: Ethernet Controllers 1V ~ 5.25V IEEE 802.3, USB 2.0, USB 1.1 MII, SPI, USB QFN-24_4x4x05P Ethernet ICs ROHS; LCSC PN: C50656
Y2 = ABM8G-25.000MHZ-B4Y-T: 25 MHz ±30ppm Crystal 10pF 60 Ohms 4-SMD, No Lead / SMD3225-4P; Manufacturer: Abracon; ESR (Equivalent Series Resistance): 60R; Supplier 1: Digi-Key; Supplier Part Number 1: 535-10297-1-ND; Manufacturer Part Number: ABM8G-25.000MHZ-B4Y-T; RoHS: Yes; Category: Crystals; Stock 1: 123; Pricing 1: 1=0.82000, 10=0.72900, 50=0.68120, 100=0.60190, 500=0.57024 (USD); Mount: Surface Mount; Case/Package: SMD/SMT; Number of Pins: 4; Min Operating Temperature: -20°C; Max Operating Temperature: 70°C; Packaging: Tape and Reel; Frequency Tolerance: 30ppm; Load Capacitance: 10pF; Frequency: 25MHz; Package Quantity: 1000; Tolerance: 30ppm; Frequency Stability: 30ppm; Termination: SMD/SMT; Series: ABM8G; Series Resistance: 60R; Operating Frequency: 25 MHz; Length: 3.2mm; Width: 0.098inch; Height: 0.039inch; Depth: 2.5mm; REACH SVHC: Unknown; Lead Free: Lead Free; ComponentLink1URL: https://datasheet.ciiva.com/855/abm8g-855228.pdf?src-supplier=Digi-Key; ComponentLink1Description: https://datasheet.ciiva.com/855/abm8g-855228.pdf?src-supplier=Digi-Key; ComponentLink2URL: https://datasheet.ciiva.com/855/abm8g-855229.pdf?src-supplier=Digi-Key; ComponentLink2Description: https://datasheet.ciiva.com/855/abm8g-855229.pdf?src-supplier=Digi-Key; ComponentLink3URL: https://datasheet.ciiva.com/855/abm8g-855230.pdf?src-supplier=Digi-Key; ComponentLink3Description: https://datasheet.ciiva.com/855/abm8g-855230.pdf?src-supplier=Digi-Key; ComponentLink4URL: https://datasheet.ciiva.com/4945/abm8g-10572-4945134.pdf?src-supplier=Mouser; ComponentLink4Description: https://datasheet.ciiva.com/4945/abm8g-10572-4945134.pdf?src-supplier=Mouser; ComponentLink5URL: https://datasheet.ciiva.com/7998/abm8g-7998635.pdf?src-supplier=Element14; ComponentLink5Description: https://datasheet.ciiva.com/7998/abm8g-7998635.pdf?src-supplier=Element14; ComponentLink6URL: https://datasheet.ciiva.com/28508/1883677-28508586.pdf?src-supplier=Element14; ComponentLink6Description: https://datasheet.ciiva.com/28508/1883677-28508586.pdf?src-supplier=Element14; ComponentLink7URL: https://datasheet.ciiva.com/16416/abm8g-16416874.pdf?src-supplier=Future+Electronics; ComponentLink7Description: https://datasheet.ciiva.com/16416/abm8g-16416874.pdf?src-supplier=Future+Electronics; LCSC PN: C9006

## Sheet SD_Reader.SchDoc: ET4X Full Dock
size A; DrawnBy: KEW; RevisionEngineer: KEW; ProjectTitle: USB-OTG Puck; Revision: X2; SheetNumber: 5; SheetTotal: 5; DrawnByDate: 1/18/2023; ProjectNumber: TBD; AssemblyNumber: TBD; RevisionDate: 7/21/2023; SheetTitle: SD Card; Date: 1/10/2023; ApprovedBy: KEW; CheckedBy: KEW; Author: KEW; CompanyName: Gamber-Johnson LLC.; Engineer: KEW; Organization: Gamber-Johnson LLC.; Address1: 5001 Joerns Dr.; Address2: Stevens Point, WI; Address3: 54481; DocumentNumber: TBD; SPICEModelCacheFYOWLMMU: <root> / <DocumentId>FYOWLMMU</DocumentId> / </root>; Application_BuildNumber: TBD; Time: 9:32AM
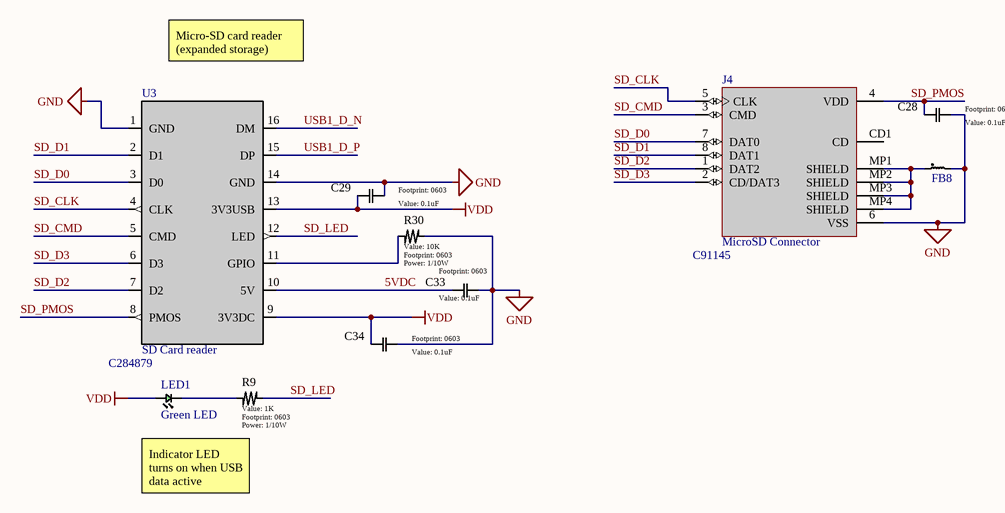
[diagram p4: SD_Reader.SchDoc]

### Parts
C28  value 0.1uF  [0603]  (hidden comment: Generic Capacitor)
C29  value 0.1uF  [0603]  (hidden comment: Generic Capacitor)
C33  value 0.1uF  [0603]  (hidden comment: Generic Capacitor)
C34  value 0.1uF  [0603]  (hidden comment: Generic Capacitor)
FB8  C2971883; PE-0603FB121ST  [0603]  (value not drawn)
J4  MicroSD Connector  LCSC PN: C91145  [TF-01A]
LED1  Green LED  [0603 (1608 Metric) Concave]
R9  value 1K  Power: 1/10W  [0603]  (hidden comment: Generic Resistor)
R30  value 10K  Power: 1/10W  [0603]  (hidden comment: Generic Resistor)
U3  SD Card reader  LCSC PN: C284879  [SSOP-16-150mil]

### Nets
5VDC: C33.2 U3.10(5V)
GND: C28.1 C29.1 C33.1 C34.1 FB8.2 J4.6(VSS) R30.1 U3.1(GND) U3.14(GND)
VDD: C29.2 C34.2 LED1.2(Anode) U3.9(3V3DC) U3.13(3V3USB)
SD_CLK: J4.5(CLK) U3.4(CLK)
SD_CMD: J4.3(CMD) U3.5(CMD)
SD_D0: J4.7(DAT0) U3.3(D0)
SD_D1: J4.8(DAT1) U3.2(D1)
SD_D2: J4.1(DAT2) U3.7(D2)
SD_D3: J4.2(CD/DAT3) U3.6(D3)
SD_LED: R9.1 U3.12(LED)
SD_PMOS: C28.2 J4.4(VDD) U3.8(PMOS)
USB1_D_N: U3.16(DM)
USB1_D_P: U3.15(DP)
NetFB8_1: FB8.1 J4.MP1(SHIELD) J4.MP2(SHIELD) J4.MP3(SHIELD) J4.MP4(SHIELD)
NetLED1_1: LED1.1(Cathode) R9.2
NetR30_2: R30.2 U3.11(GPIO)

Not connected (* = marked no-connect by the designer): J4 CD1(CD)

### Notes on the sheet
- Micro-SD card reader
  (expanded storage)
- Indicator LED turns on when USB data active
- REV
- REVISIONS
- DATE
- DESCRIPTION
- BY
- UNLESS OTHERWISE SPECIFIED, DRAWING DEFINITIONS AND TOLERANCES SHALL BE FOUND UNDER SUPPLIER STANDARDS SS-001. THIS PART AND ALL COMPONENTS OF IT MUST BE RoHS & REACH COMPLIANT. A CERTIFICATE OF COMPLIANCE MUST BE PROVIDED UPON REQUEST.
- ALL INFORMATION ON THIS DOCUMENT IS THE SOLE PROPERTY OF GAMBER-JOHNSON AND SHALL NOT BE COPIED, REPRODUCED, USED OR DISCLOSED IN WHOLE OR IN PART WITHOUT THE WRITTEN CONSENT OF GAMBER-JOHNSON
- TOLERANCES
  .00 ± .060
  .000 ± .020
  .0000 ± .005
  ANGELS ± 1°
- DRAWN BY:
- PROJECT NUMBER:
- SHEET TITLE:
- SHEET
- OF
- DATE:
- LOCATION:
- ASSEMBLY NUMBER
- SIZE
- GAMBER-JOHNSON LLC
  5001 JOERNS DR.
  STEVENS POINT, WI 54481
  +1 (715) 344-5209
- B

### Library data of the parts
C28 C29 C33 C34 = Generic Capacitor: Voltage: >10V; Tolerance: 10%
FB8 = PE-0603FB121ST: 120 Ohms @ 100 MHz 1 Signal Line Ferrite Bead 0603 (1608 Metric) 500mA 180mOhm; Manufacturer: Pulse; Number of Lines: 1; DC Resistance (DCR): 180mR; Supplier 1: Digi-Key; Supplier Part Number 1: 553-2382-1-ND; Manufacturer Part Number: PE-0603FB121ST; RoHS: Yes; Category: Inductors; Stock 1: 6181; Pricing 1: 1=0.10000, 10=0.04400, 25=0.03920, 50=0.03580, 100=0.03220, 250=0.02360, 500=0.01716, 1000=0.01680 (USD); Mount: Surface Mount; Case/Package: 0603; Case Code (Metric): 1608; Case Code (Imperial): 0603; Min Operating Temperature: -40°C; Max Operating Temperature: 105°C; Package Quantity: 4000; Packaging: Tape and Reel; Max Current Rating: 500mA; Length: 0.063inch; Width: 0.031inch; Height: 0.037inch; RoHS Compliant: Yes; ComponentLink1URL: https://productfinder.pulseeng.com/doc_type/WEB301/doc_num/WC706/doc_part/WC706.pdf?src-supplier=Digi-Key; ComponentLink1Description: https://productfinder.pulseeng.com/doc_type/WEB301/doc_num/WC706/doc_part/WC706.pdf?src-supplier=Digi-Key; ComponentLink2URL: http://productfinder.pulseeng.com/products/datasheets/WC706.pdf?src-supplier=Digi-Key; ComponentLink2Description: http://productfinder.pulseeng.com/products/datasheets/WC706.pdf?src-supplier=Digi-Key; LCSC PN: C127301
J4 = TF-01A: Deck MicroSD card (TF card) Self bomb SMD SD Card Connector
LED1 = LTST-C191KGKT: LED Uni-Color Green 574nm 2-Pin Chip LED T/R; Manufacturer 1: Vishay Lite-On; Lens Color: Colorless; Luminous Intensity: 35mcd; Viewing Angle: 130°; Forward Voltage: 2V; Dominant Wavelength: 571nm; Test Current: 20mA; Lens Transparency: Clear; Lens Style: Rectangular,Colorless; Forward Current: 30mA; Number of Elements: 1; Power Dissipation: 75mW; Reverse Voltage: 5V; Supplier 1: RSComponents; Manufacturer Part Number 1: LTST-C191KGKT; RoHS: Yes; Category: LEDs; Stock 1: 4150; Pricing 1: 50=0.14800, 250=0.06800, 500=0.06400, 1250=0.05400, 2500=0.05100 (USD); Mount: Surface Mount; Case/Package: 0603; Number of Pins: 2; Color: Green; Case Code (Metric): 1608; Case Code (Imperial): 0603; Min Operating Temperature: -55°C; Max Operating Temperature: 85°C; Packaging: Tape and Reel; Package Quantity: 1; Wavelength: 574nm; Illumination Color: Green; Number of LEDs: 1; Power Rating: 75mW; Max Power Dissipation: 75mW; Length: 1.6mm; Width: 0.8mm; Height: 0.55mm; Depth: 0.8mm; Radiation Hardening: No; Lead Free: Lead Free; RoHS Compliant: Yes; ComponentLink1URL: https://datasheet.ciiva.com/2109/ltst-c191kgkt-2109973.pdf?src-supplier=Digi-Key; ComponentLink1Description: https://datasheet.ciiva.com/2109/ltst-c191kgkt-2109973.pdf?src-supplier=Digi-Key; Supplier Part Number 1: 6921010
R9 R30 = Generic Resistor: Tolerance: 1%
U3 = GL823K-HCY04: USB 2.0 SD/MSPRO Card Reader Controller

## Nets that join several sheets
3.3VDC: Power Regulation (5 pins), USB Hub (16 pins)
5VDC: Power Regulation (5 pins), USB Hub (6 pins), LAN_RJ45 (C69.1 U17.11), SD_Reader (C33.2 U3.10)
DC-OUT: Power Regulation (SW1.2 SW1.5), USB Hub (J2.A4/B9 J2.B4/A9)
GND: Power Regulation (26 pins), USB Hub (33 pins), LAN_RJ45 (22 pins), SD_Reader (9 pins)
USB1_D_N: USB Hub (U4.27), SD_Reader (U3.16)
USB1_D_P: USB Hub (U4.28), SD_Reader (U3.15)
USB2_D_N: USB Hub (U4.2), LAN_RJ45 (U17.7)
USB2_D_P: USB Hub (U4.3), LAN_RJ45 (U17.8)